# EAGLE design MO-bela-lightspace-B (EAGLE 8.5.0)
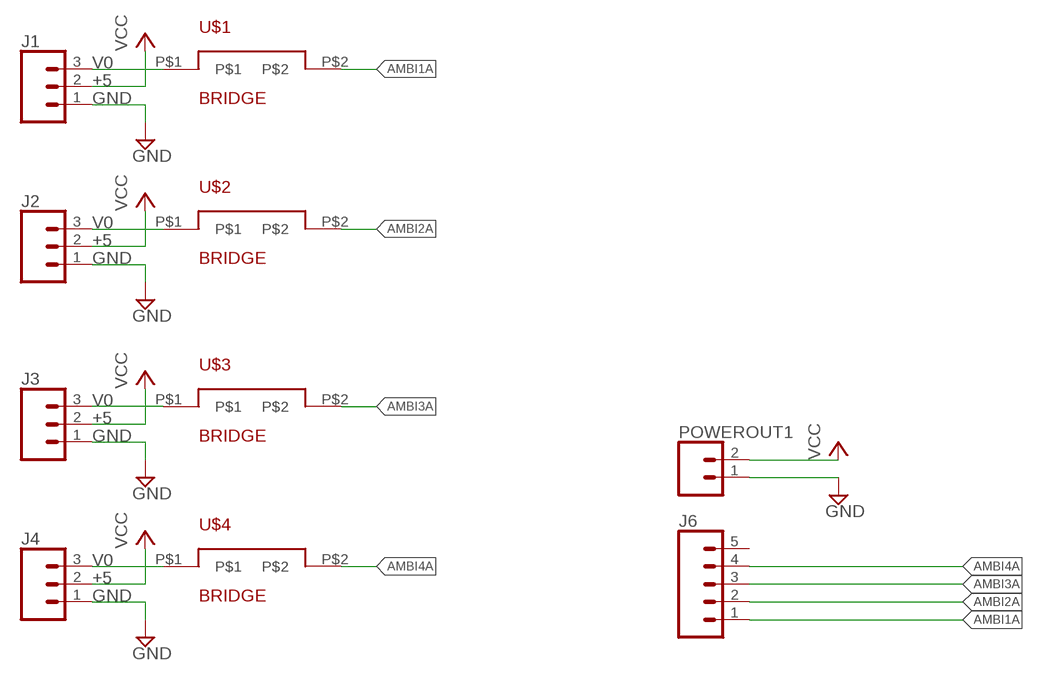
[diagram p0: schematic, sheet 1]

## Parts
J1  CONN_03LOCK  [1X03_LOCK]
J2  CONN_03LOCK  [1X03_LOCK]
J3  CONN_03LOCK  [1X03_LOCK]
J4  CONN_03LOCK  [1X03_LOCK]
J6  CONN_05LOCK  [1X05_LOCK]
POWEROUT1  CONN_02LOCK  [1X02_LOCK]
U$1  BRIDGE  [BRIDGE]
U$2  BRIDGE  [BRIDGE]
U$3  BRIDGE  [BRIDGE]
U$4  BRIDGE  [BRIDGE]

## Nets
AMBI1A: J6.1 U$1.P$2
AMBI2A: J6.2 U$2.P$2
AMBI3A: J6.3 U$3.P$2
AMBI4A: J6.4 U$4.P$2
GND: J1.1 J2.1 J3.1 POWEROUT1.1
MNOVE: J4.1 ; supply symbol labelled GND
N$1: J1.3 U$1.P$1
N$2: J2.3 U$2.P$1
N$3: J3.3 U$3.P$1
N$4: J4.3 U$4.P$1
VCC: J1.2 J2.2 J3.2 J4.2 POWEROUT1.2
Unconnected: J6.5

## Library data of the parts
J1-J4 = SparkFun-Connectors:CONN_03: Multi connection point. Often used as Generic Header-pin footprint for 0.1 inch spaced/style header connections On any of the 0.1 inch spaced packages, you can populate with these: Break Away Headers - Straight <https://www.sparkfun.com/products/116> (PRT-00116) Break Away Male Headers - Right Angle <https://www.sparkfun.com/products/553> (PRT-00553) Female Headers <https://www.sparkfun.com/products/115> (PRT-00115) Break Away Headers - Machine Pin <https://www.sparkfun.com/products/117> (PRT-00117) Break Away Female Headers - Swiss Machine Pin <https://www.sparkfun.com/products/743> (PRT-00743) Stackable Header - 3 Pin (Female, 0.1") <https://www.sparkfun.com/products/13875> (PRT-13875) For SCREWTERMINALS and SPRING TERMINALS visit here: Screw Terimnals on SparkFun.com <https://www.sparkfun.com/search/results?term=Screw+Terminals> (5mm/3.5mm/2.54mm spacing) This device is also useful as a general connection point to wire up your design to another part of your project. Our various solder wires solder well into these plated through hole pads. Hook-Up Wire - Assortment (Stranded, 22 AWG) <https://www.sparkfun.com/products/11375> (PRT-11375) Hook-Up Wire - Assortment (Solid Core, 22 AWG) <https://www.sparkfun.com/products/11367> (PRT-11367) View the entire wire category on our website here <https://www.sparkfun.com/categories/141> Special notes: Molex polarized connector foot print use with SKU : PRT-08232 with associated crimp pins and housings.; 5: +5; GND: GND; V0: V0
J6 = SparkFun-Connectors:CONN_05: Multi connection point. Often used as Generic Header-pin footprint for 0.1 inch spaced/style header connections On any of the 0.1 inch spaced packages, you can populate with these: Break Away Headers - Straight <https://www.sparkfun.com/products/116> (PRT-00116) Break Away Male Headers - Right Angle <https://www.sparkfun.com/products/553> (PRT-00553) Female Headers <https://www.sparkfun.com/products/115> (PRT-00115) Break Away Headers - Machine Pin <https://www.sparkfun.com/products/117> (PRT-00117) Break Away Female Headers - Swiss Machine Pin <https://www.sparkfun.com/products/743> (PRT-00743) For SCREWTERMINALS and SPRING TERMINALS visit here: Screw Terimnals on SparkFun.com <https://www.sparkfun.com/search/results?term=Screw+Terminals> (5mm/3.5mm/2.54mm spacing) This device is also useful as a general connection point to wire up your design to another part of your project. Our various solder wires solder well into these plated through hole pads. Hook-Up Wire - Assortment (Stranded, 22 AWG) <https://www.sparkfun.com/products/11375> (PRT-11375) Hook-Up Wire - Assortment (Solid Core, 22 AWG) <https://www.sparkfun.com/products/11367> (PRT-11367) View the entire wire category on our website here <https://www.sparkfun.com/categories/141> Special notes: Molex polarized connector foot print use with SKU : PRT-08231 with associated crimp pins and housings. 1MM SMD Version SKU: PRT-10208
POWEROUT1 = SparkFun-Connectors:CONN_02: Multi connection point. Often used as Generic Header-pin footprint for 0.1 inch spaced/style header connections On any of the 0.1 inch spaced packages, you can populate with these: Break Away Headers - Straight <https://www.sparkfun.com/products/116> (PRT-00116) Break Away Male Headers - Right Angle <https://www.sparkfun.com/products/553> (PRT-00553) Female Headers <https://www.sparkfun.com/products/115> (PRT-00115) Break Away Headers - Machine Pin <https://www.sparkfun.com/products/117> (PRT-00117) Break Away Female Headers - Swiss Machine Pin <https://www.sparkfun.com/products/743> (PRT-00743) For SCREWTERMINALS and SPRING TERMINALS visit here: Screw Terimnals on SparkFun.com <https://www.sparkfun.com/search/results?term=Screw+Terminals> (5mm/3.5mm/2.54mm spacing) This device is also useful as a general connection point to wire up your design to another part of your project. Our various solder wires solder well into these plated through hole pads. Hook-Up Wire - Assortment (Stranded, 22 AWG) <https://www.sparkfun.com/products/11375> (PRT-11375) Hook-Up Wire - Assortment (Solid Core, 22 AWG) <https://www.sparkfun.com/products/11367> (PRT-11367) View the entire wire category on our website here <https://www.sparkfun.com/categories/141> Special notes: Molex polarized connector foot print use with: PRT-08233 with associated crimp pins and housings. 2.54_SCREWTERM for use with PRT-10571. 3.5mm Screw Terminal footprints for PRT-08084 5mm Screw Terminal footprints for use with PRT-08432
U$1-U$4 = CMU-ArtFab:BRIDGE

## Board
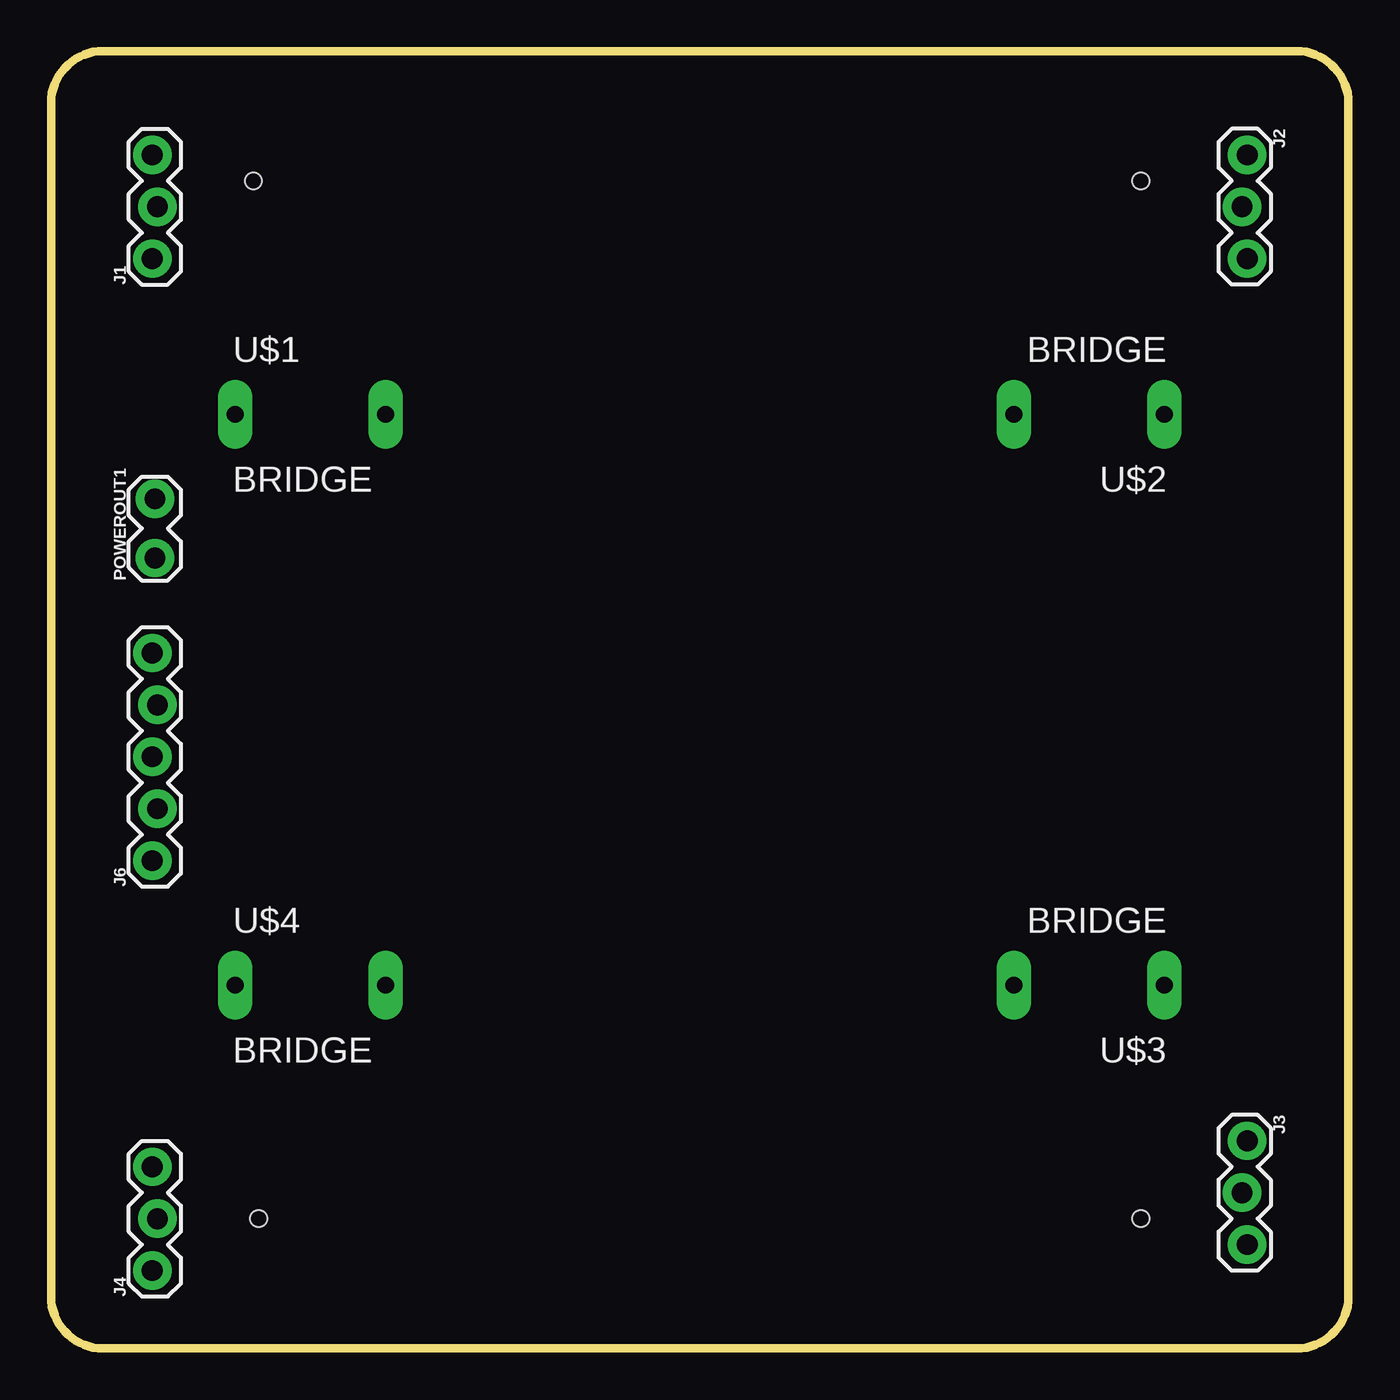
[diagram p1: board, top side]
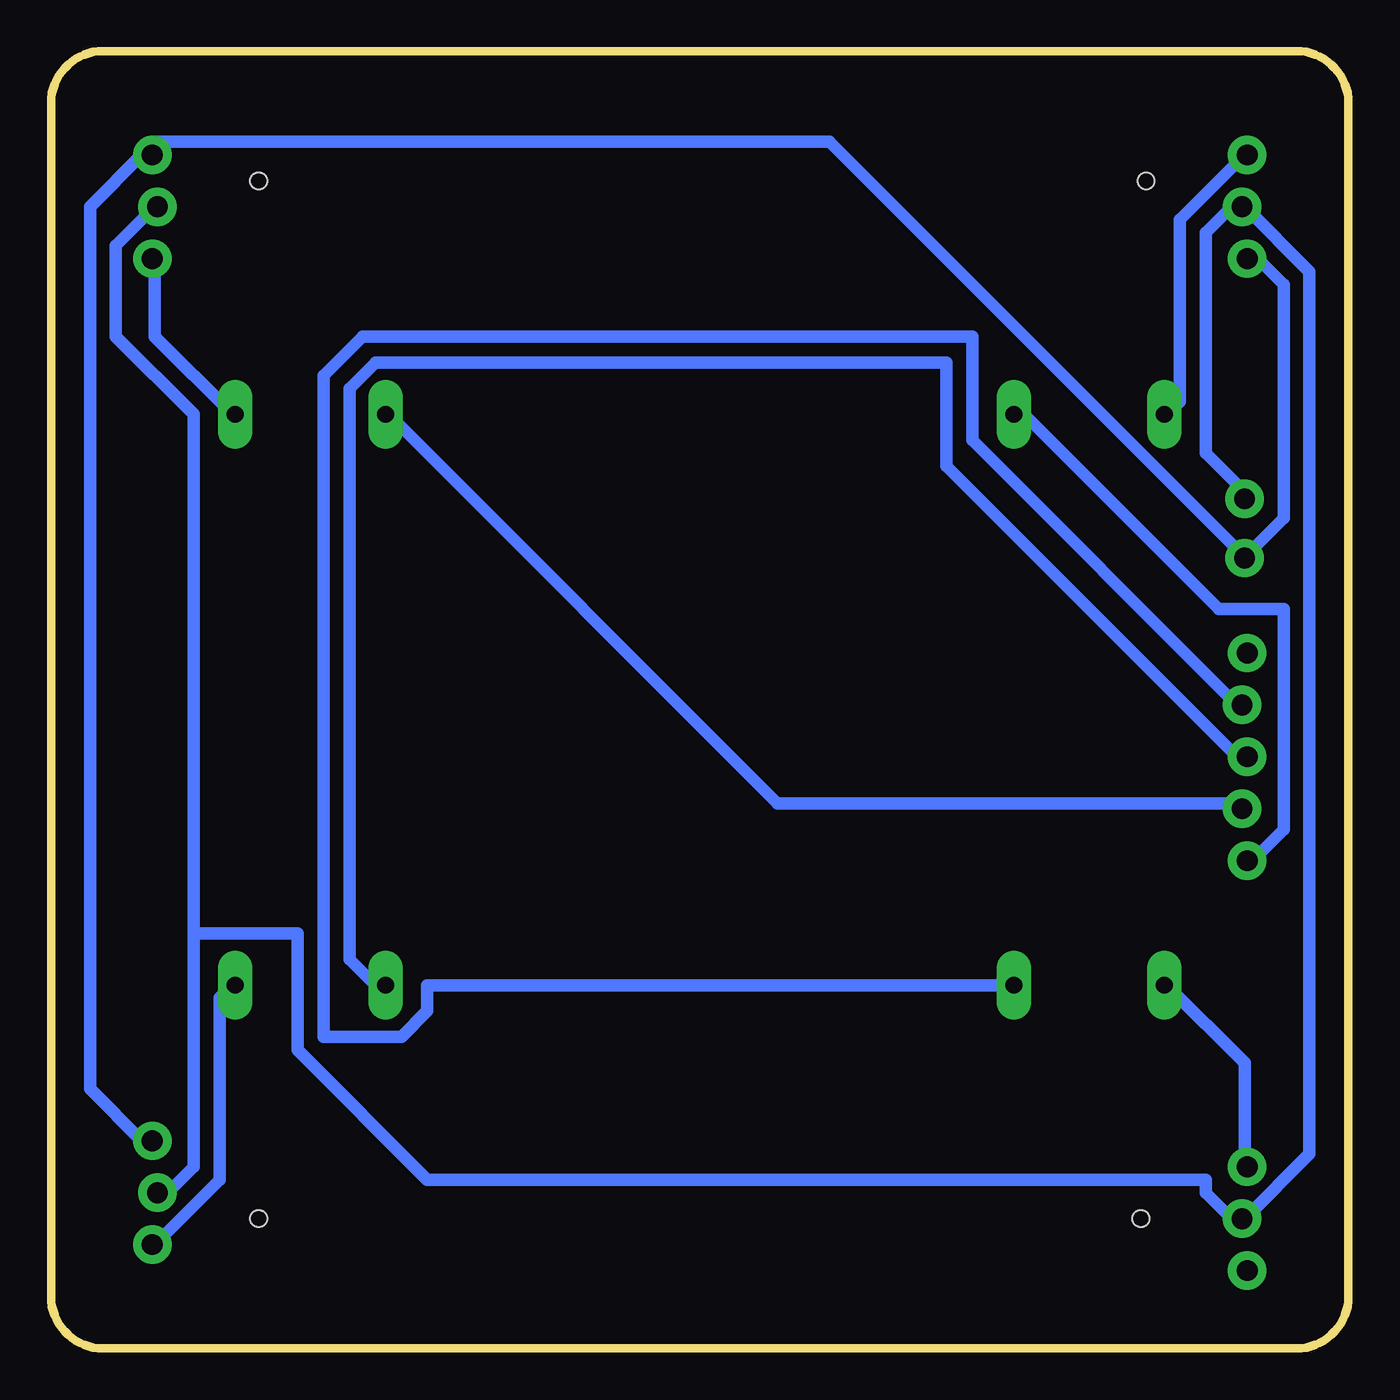
[diagram p2: board, bottom side, seen from below]

Size 63.5 x 63.5 mm. Coordinates in mm from the lower left corner, seen from the top.
Outline: 0,2.54 arc90 2.54,0 60.96,0 arc90 63.5,2.54 63.5,60.96 arc90 60.96,63.5 2.54,63.5 arc90 0,60.96 0,2.54
Copper layers (1*16): Top 0.035mm / dielectric 1.5mm / Bottom 0.035mm
Design rules "default *": minimum track width 24mil, minimum drill 0.35mm, track to track 16mil, track to pad 16mil, pad to pad 16mil, via to via 16mil, smd to smd 16mil, copper to edge 40mil, drill to drill 6mil, minimum pad ring 10mil, minimum via ring 8mil, stop-mask expansion 4mil, vias tented up to drill 0mil, thermal gap 10mil
Holes 0.81 mm at 10.16,6.35 53.34,6.35 9.91,57.15 53.34,57.15

### Footprints (pad centres in the part's own frame; a part is rotated, then mirrored left to right if it is on the bottom)
1X03_LOCK = drill 1.016 pad 1.88: 1 0,0.127; 2 2.54,-0.127; 3 5.08,0.127
1X05_LOCK = drill 1.016 pad 1.88: 1 0,0.127; 2 2.54,-0.127; 3 5.08,0.127; 4 7.62,-0.127; 5 10.16,0.127
1X02_LOCK = drill 1.016 pad 1.88: 1 -0.178,0; 2 2.718,0
BRIDGE = drill 0.829 pad 1.676 long: P$1 -3.683,0; P$2 3.683,0

### Placement (x,y rotation side)
J1  5.08,53.34 90 top
J2  58.42,58.42 270 top
J3  58.42,10.16 270 top
J4  5.08,3.81 90 top
J6  5.08,23.88 90 top
POWEROUT1  5.08,38.86 90 top
U$1  12.7,45.72 0 top
U$2  50.8,45.72 180 top
U$3  50.8,17.78 180 top
U$4  12.7,17.78 0 top

### Tracks (layer width: path | path; a pad name or v marks a point on that pad's centre or on a via)
AMBI1A
  Bottom 0.61: U$1.P$2 15.88,45.72 6.35,36.2 3.17,36.2 3.17,25.4 4.45,24.13 J6.1
AMBI2A
  Bottom 0.61: U$2.P$2 46.99,45.72 27.94,26.67 5.71,26.67 J6.2
AMBI3A
  Bottom 0.61: U$3.P$2 47.62,17.78 48.9,19.05 48.9,46.99 47.62,48.26 19.68,48.26 19.68,43.18 5.08,28.57 J6.3
AMBI4A
  Bottom 0.61: U$4.P$2 45.09,17.78 45.09,16.51 46.35,15.24 50.16,15.24 50.16,47.62 48.26,49.53 18.41,49.53 18.41,44.45 5.71,31.75 J6.4
GND
  Bottom 0.61: 5.08,38.73 3.17,40.64 3.17,52.07 4.45,53.34 J1.1 | J3.1 59.05,10.16 61.59,12.7 61.59,55.88 59.05,58.42 J2.1 58.42,58.42 58.42,59.05 25.4,59.05 5.08,38.73 | 5.08,38.73 POWEROUT1.1
N$1
  Bottom 0.61: U$1.P$1 8.89,45.72 8.26,46.35 8.26,55.24 5.08,58.42 J1.3
N$2
  Bottom 0.61: U$2.P$1 54.61,45.72 58.42,49.53 58.42,53.34 J2.3
N$3
  Bottom 0.61: U$3.P$1 54.61,17.78 55.24,17.14 55.24,8.26 58.42,5.08 J3.3
N$4
  Bottom 0.61: U$4.P$1 8.89,17.78 5.08,13.97 5.08,8.89 J4.3
VCC
  Bottom 0.61: 56.52,20.32 56.52,45.72 60.33,49.53 60.33,53.98 58.42,55.88 J2.2 | 56.52,20.32 56.52,8.89 57.78,7.62 J3.2 | POWEROUT1.2 5.08,41.91 6.99,43.81 6.99,54.61 5.71,55.88 J1.2 5.08,55.88 1.91,52.7 1.91,9.53 5.08,6.35 J4.2 5.71,6.35 6.99,7.62 6.99,8.26 45.09,8.26 51.44,14.61 51.44,20.32 56.52,20.32